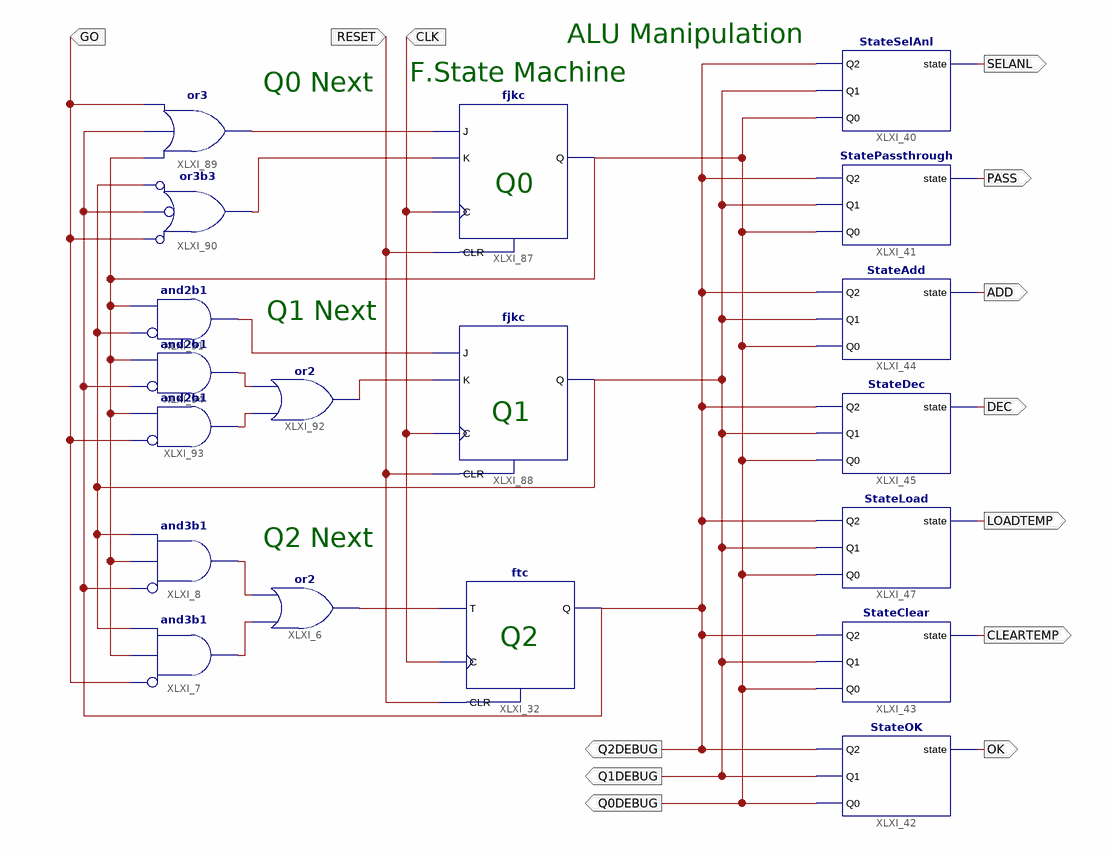
[diagram p0: schematic sheet 1]
// Xilinx ISE schematic Controlo.sch (spartan3e) as structural Verilog: 19 symbols, 13 ports
module Controlo (
  input  CLK,
  input  RESET,
  input  GO,
  output SELANL,
  output PASS,
  output Q1DEBUG,
  output Q2DEBUG,
  output Q0DEBUG,
  output LOADTEMP,
  output CLEARTEMP,
  output ADD,
  output DEC,
  output OK
);

  wire XLXN_6, XLXN_8, XLXN_15, XLXN_16, XLXN_78, XLXN_114, XLXN_125, XLXN_126, XLXN_127;

  ftc XLXI_32 (.C(CLK), .CLR(RESET), .T(XLXN_8), .Q(Q2DEBUG));
  and XLXI_8 (XLXN_16, ~Q2DEBUG, Q0DEBUG, Q1DEBUG);  // and3b1
  or XLXI_6 (XLXN_8, XLXN_15, XLXN_16);
  and XLXI_7 (XLXN_15, ~GO, Q0DEBUG, Q1DEBUG);  // and3b1
  StateOK XLXI_42 (.Q0(Q0DEBUG), .Q1(Q1DEBUG), .Q2(Q2DEBUG), .state(OK));
  StateClear XLXI_43 (.Q0(Q0DEBUG), .Q1(Q1DEBUG), .Q2(Q2DEBUG), .state(CLEARTEMP));
  StateLoad XLXI_47 (.Q0(Q0DEBUG), .Q1(Q1DEBUG), .Q2(Q2DEBUG), .state(LOADTEMP));
  StateDec XLXI_45 (.Q0(Q0DEBUG), .Q1(Q1DEBUG), .Q2(Q2DEBUG), .state(DEC));
  StateAdd XLXI_44 (.Q0(Q0DEBUG), .Q1(Q1DEBUG), .Q2(Q2DEBUG), .state(ADD));
  StateSelAnl XLXI_40 (.Q0(Q0DEBUG), .Q1(Q1DEBUG), .Q2(Q2DEBUG), .state(SELANL));
  StatePassthrough XLXI_41 (.Q0(Q0DEBUG), .Q1(Q1DEBUG), .Q2(Q2DEBUG), .state(PASS));
  fjkc XLXI_87 (.C(CLK), .CLR(RESET), .J(XLXN_114), .K(XLXN_6), .Q(Q0DEBUG));
  fjkc XLXI_88 (.C(CLK), .CLR(RESET), .J(XLXN_127), .K(XLXN_78), .Q(Q1DEBUG));
  or XLXI_89 (XLXN_114, Q0DEBUG, Q2DEBUG, GO);
  or XLXI_90 (XLXN_6, ~GO, ~Q2DEBUG, ~Q1DEBUG);  // or3b3
  and XLXI_91 (XLXN_127, ~Q1DEBUG, Q0DEBUG);  // and2b1
  or XLXI_92 (XLXN_78, XLXN_125, XLXN_126);
  and XLXI_93 (XLXN_125, ~GO, Q0DEBUG);  // and2b1
  and XLXI_94 (XLXN_126, ~Q2DEBUG, Q0DEBUG);  // and2b1

  // Notes on the sheet:
  //   ALU Manipulation
  //   F.State Machine
  //   Q0 Next
  //   Q0
  //   Q1 Next
  //   Q1
  //   Q2 Next
  //   Q2
endmodule
